# Altium schematic sheet Teensy_Interposer_Board.SchDoc
size B; SheetNumber: 1; SheetTotal: 1; ENG_APP_DATE: --/--/--; DSN_APP_DATE: --/--/--; CHK_APP_DATE: --/--/--
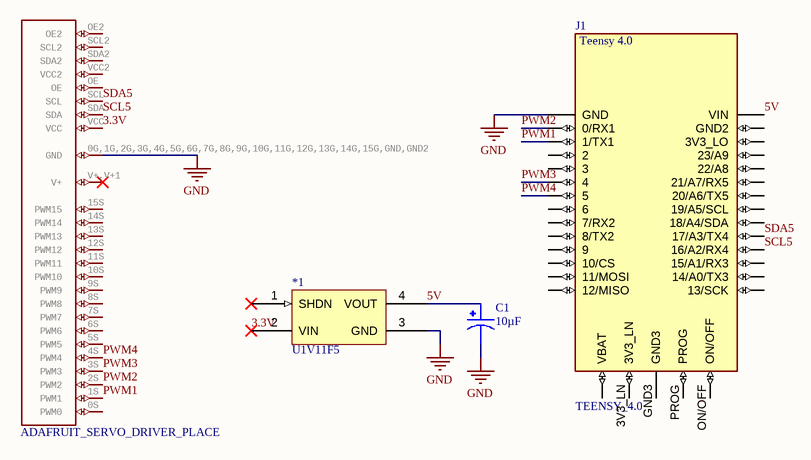
[diagram p0: Teensy_Interposer_Board.SchDoc]

## Parts
1  ADAFRUIT_SERVO_DRIVER_PLACE  [ADAFRUIT_SERVO_DRIVER_PLACE]
*1  U1V11F5  [U1V11F5-Footprint-1]
C1  value 10µF  [CAPPM7343X310N]  (hidden comment: TPSD106K025R0500)
J1  TEENSY_4.0  [TEENSY_4.0]

## Nets
GND: 1.0G,1G,2G,3G,4G,5G,6G,7G,8G,9G,10G,11G,12G,13G,14G,15G,GND,GND2(GND) *1.3(GND) C1.2 J1.GND
3.3V: 1.VCC *1.2(VIN)
5V: *1.4(VOUT) C1.1 J1.VIN
PWM1: 1.1S(PWM1) J1.1/TX(1/TX1)
PWM2: 1.2S(PWM2) J1.0/RX(0/RX1)
PWM3: 1.3S(PWM3) J1.4/CANRX(4)
PWM4: 1.4S(PWM4) J1.5
SCL5: 1.SDA J1.16/A2(16/A2/RX4)
SDA5: 1.SCL J1.17/A3(17/A3/TX4)

Not connected (* = marked no-connect by the designer): 1 0S(PWM0) 5S(PWM5) 6S(PWM6) 7S(PWM7) 8S(PWM8) 9S(PWM9) 10S(PWM10) 11S(PWM11) 12S(PWM12) 13S(PWM13) 14S(PWM14) 15S(PWM15) OE OE2 SCL2 SDA2 V+,V+1(V+)* VCC2; *1 1(SHDN)*; J1 2 3/CANTX(3) 3V3_LN 3V3_LO 6 7(7/RX2) 8(8/TX2) 9/CS(9) 10/CS 11/MOSI 12/MISO 13/SCK 14/A0(14/A0/TX3) 15/A1(15/A1/RX3) 18/A4/SDA 19/A5/SCL 20/A6(20/A6/TX5) 21/A7(21/A7/RX5) 22/A8 23/A9 GND2 GND3 ON/OFF PROG VBAT\(VBAT)

## Notes on the sheet
- DWG. NO.
- REV.
- SHT.
- THIS DOCUMENT AND THE DATA DISCLOSED HEREIN OR HEREWITH IS THE PROPERTY OF ALTIUM LIMITED AND MAY BE FREELY DISTRIBUTED IN WHOLE. NO RIGHTS ARE RESERVED OR EXPRESS OR IMPLIED WARANTEE GIVEN.
- REVISION
- DESCRIPTION
- DATE
- APPROVED
- ENG:
- APPROVALS
- PROJECT
- DSN:
- CHK:
- REFERENCE DOCUMENTS
- PROJECT REVISION:
- TITLE
- DOCUMENT REVISION:
- DESIGN ITEM:
- BOM:
- FAB DWG:
- PCB DWG:
- ASSY DWG:
- SCALE:
- SIZE
- B
- CAGE CODE
- FILE NAME
- DWG NO.
- SHEET
- OF
- REV

## Library data of the parts
1 = CMP-012-000005-1: GateName_1: G$1; Source: BackBottom+v1.SCHLIB; Pin Count: 26; Design Item ID: ADAFRUIT_SERVO_DRIVER_PLACE; Component Type: Standard; DeviceSetName: ADAFRUIT_SERVO_DRIVER_PLACE; SymbolName_1: ADAFRUIT_SERVO_DRIVER_PLACE; Package: ADAFRUIT_SERVO_DRIVER_PLACE; LibraryName: BackBottom+v1
*1 = CMP-019-00052-4: Pololu 5V Step-Up Voltage Regulator U1V11F5; Min Supply Voltage: 500mV; Pins: Vin, Vout, GND, SHDN; Output Voltage: 5V
C1 = CMP-001-00916-1: Low ESR MnO2,10 uF,25 V; MF: AVX; Design Item ID: TPSD106K025R0500; Component Type: Standard; MP: TPSD106K025R0500; Case/Package: None; Pins: 2; Check_prices: https://www.snapeda.com/parts/TPSD106K025R0500/AVX/view-part/?ref=eda; SnapEDA_Link: https://www.snapeda.com/parts/TPSD106K025R0500/AVX/view-part/?ref=snap; Source: TPSD106K025R0500.SchLib
J1 = CMP-003-000002-4: Teensy 4.0; MF: PJRC; Package: None; Pin Count: 33; MP: Teensy 4.0; Source: TEENSY_4.0.SchLib; Design Item ID: TEENSY_4.0; Value: *; SnapEDA_Link: https://www.snapeda.com/parts/Teensy%204.0/PJRC/view-part/?ref=snap; Check_prices: https://www.snapeda.com/parts/Teensy%204.0/PJRC/view-part/?ref=eda; Component Type: Standard